# EAGLE design Barometer Sensor(BMP180) v1.0 (EAGLE 6.4)
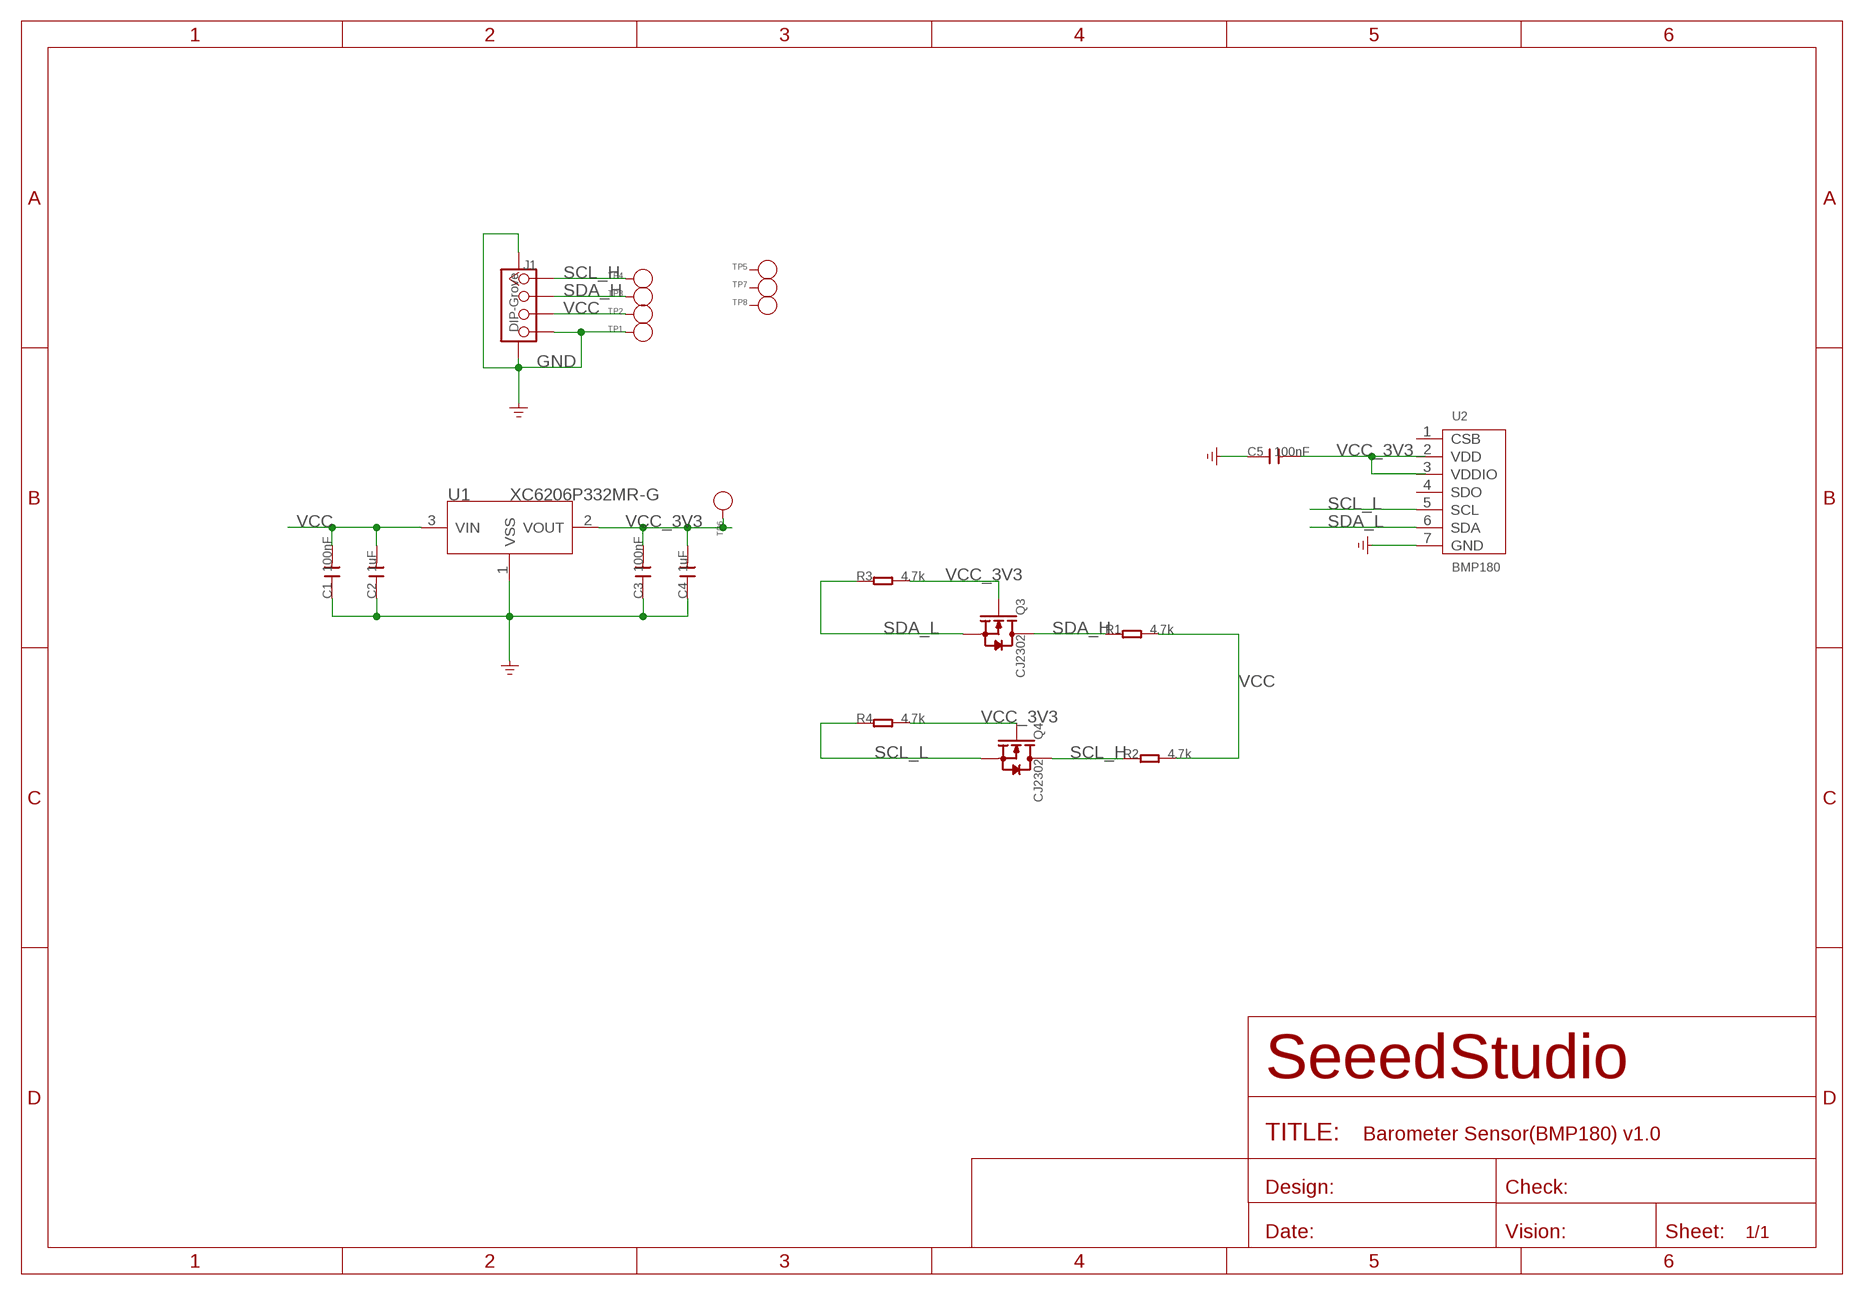
[diagram p0: schematic, sheet 1]

## Parts
C1  100nF  C-0603  [C0603]
C2  1uF  C-0603  [C0603]
C3  100nF  C-0603  [C0603]
C4  1uF  C-0603  [C0603]
C5  100nF  C-0603  [C0603]
J1  DIP-Grove  TWIG-4P-2.0-SMD-FEMALE-REINFORCE'DD'  [4P-SMD-2.0]
Q3  CJ2302  MOSFET-N-044020001  [SOT23]
Q4  CJ2302  MOSFET-N-044020001  [SOT23]
R1  4.7k  R-0603  [R0603]
R2  4.7k  R-0603  [R0603]
R3  4.7k  R-0603  [R0603]
R4  4.7k  R-0603  [R0603]
TP1  PAD-TEST-POINT'4545'  [TP_4545]
TP2  PAD-TEST-POINT'4545'  [TP_4545]
TP3  PAD-TEST-POINT'4545'  [TP_4545]
TP4  PAD-TEST-POINT'4545'  [TP_4545]
TP5  PAD-TEST-POINT'4545'  [TP_4545]
TP6  PAD-TEST-POINT'4545'  [TP_4545]
TP7  PAD-TEST-POINT'4545'  [TP_4545]
TP8  PAD-TEST-POINT'4545'  [TP_4545]
U1  XC6206P332MR-G  XC6206MR  [SOT23]
U2  BMP180  [LGA-7]

## Nets
GND: C1.1 C2.1 C3.1 C4.1 J1.4 J1.SS1 J1.SS2 TP1.T U1.1(VSS) U2.7(GND)
SCL_H: J1.1 Q4.3(D) R2.1 TP4.T
SCL_L: Q4.2(S) R4.1 U2.5(SCL)
SDA_H: J1.2 Q3.3(D) R1.1 TP3.T
SDA_L: Q3.2(S) R3.1 U2.6(SDA)
VCC: C1.2 C2.2 J1.3 R1.2 R2.2 TP2.T U1.3(VIN)
VCC_3V3: C3.2 C4.2 C5.2 Q3.1(G) Q4.1(G) R3.2 R4.2 TP6.T U1.2(VOUT) U2.2(VDD) U2.3(VDDIO)
Unconnected: C5.1 TP5.T TP7.T TP8.T U2.1(CSB) U2.4(SDO)

## Library data of the parts
C1-C5 = Discrete:C*: Ceramic Capacitors
J1 = Connector :TWIG-4P-2.0-SMD-FEMALE-REINFORCE
Q3 Q4 = OPL:MOSFET-N: CJ2302：SMD MOSFET N-CH 20V-2.1A
R1-R4 = Discrete:R*
TP1-TP8 = Discrete:PAD-TEST-POINT; PARTNO: DNP
U1 = IC:XC6206: LOW ESR Cap.Compatible Positive Voltage Regulators
U2 = template :BMP180: Digital pressure sensor

## Board
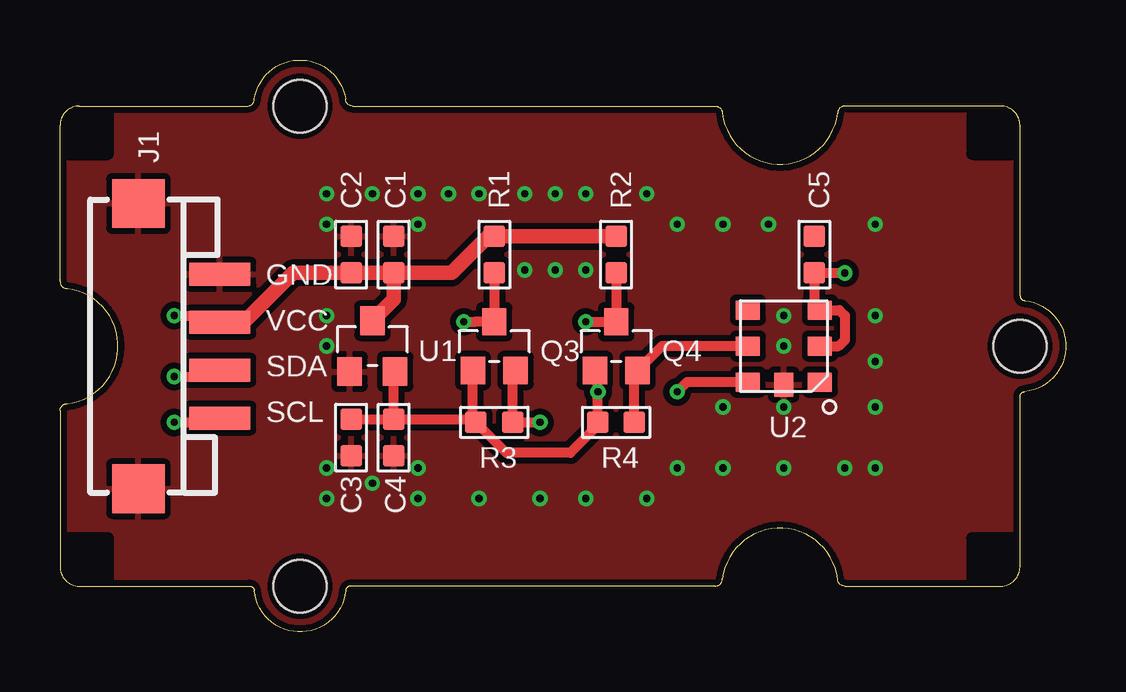
[diagram p1: board, top side]
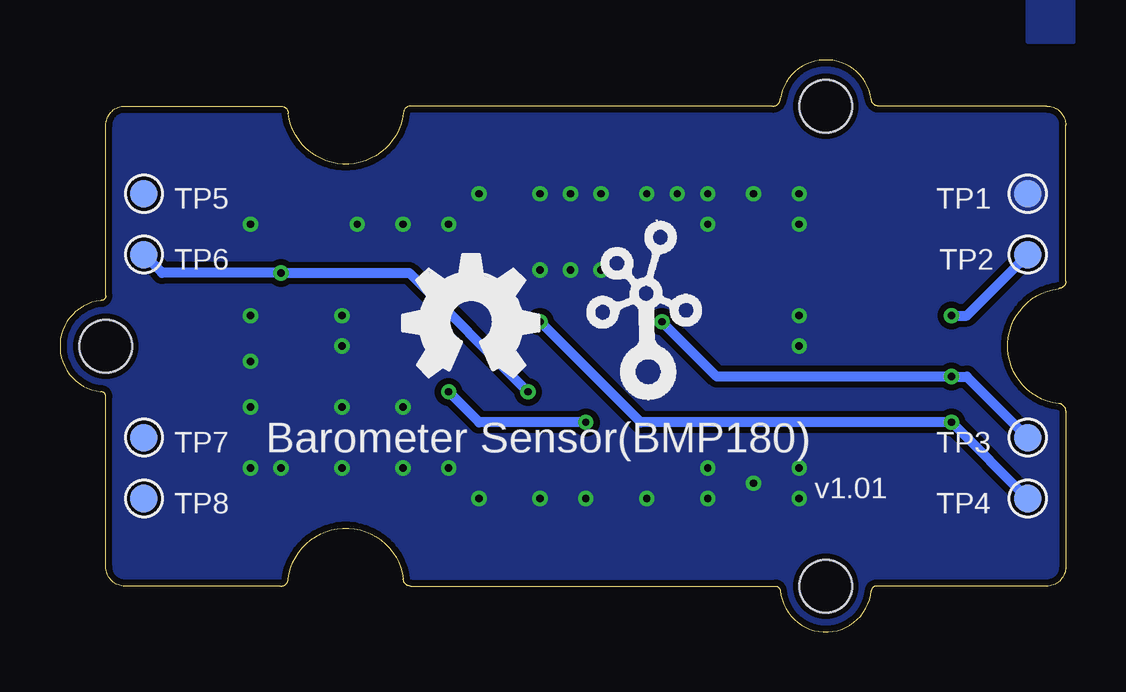
[diagram p2: board, bottom side, seen from below]

Size 41.91 x 23.83 mm. Coordinates in mm from the lower left corner, seen from the top.
Copper layers (1*16): Top 0.035mm / dielectric 1.5mm / Bottom 0.035mm
Design rules "SeeedStudio_2layer_DRU_no_angle_20140221": minimum track width 6mil, minimum drill 12mil, track to track 6mil, track to pad 6mil, pad to pad 6mil, via to via 6mil, smd to smd 0mil, copper to edge 10mil, drill to drill 10mil, minimum pad ring 10mil, minimum via ring 6mil, stop-mask expansion 2mil, vias tented up to drill 25mil, thermal gap 10mil

### Footprints (pad centres in the part's own frame; a part is rotated, then mirrored left to right if it is on the bottom)
C0603 = smd 0.889 x 0.889: 1 -0.762,0; 2 0.762,0
4P-SMD-2.0 = smd 0.965 x 2.54: 1 -3,0; 2 -1,0; 3 1,0; 4 3,0 | smd 2.032 x 2.184: SS1 -5.946,3.4; SS2 5.946,3.4
SOT23 = smd 1.016 x 1.143: 1 -0.889,-1.016; 2 0.889,-1.016; 3 0,1.016
R0603 = smd 0.889 x 0.889: 1 -0.762,0; 2 0.762,0
TP_4545 = smd 1.143 x 1.143: T 0,0
SOT23' = smd 1.016 x 1.2: 1 -0.95,-1.06; 2 0.95,-1.06; 3 0,1.06
LGA-7 = smd 0.8 x 1: 1 1.5,1.5; 2 0,1.5; 3 -1.5,1.5; 4 -1.5,-1.5; 5 0,-1.5; 6 1.5,-1.5 | smd 1 x 0.8: 7 1.6,0
GROVE-2CONNECTOR-SMD = hole 2.2: -10,-10; -10,10; 20,0

### Placement (x,y rotation side)
C1  13.9,15.72 270 top
C2  12.13,15.72 270 top
C3  12.13,8.1 90 top
C4  13.9,8.1 90 top
C5  31.43,15.72 270 top
J1  6.66,11.91 90 top
Q3  18.09,11.91 0 top
Q4  23.18,11.91 0 top
R1  18.09,15.72 90 top
R2  23.18,15.72 90 top
R3  18.09,8.73 180 top
R4  23.18,8.73 180 top
TP1  1.59,18.26 0 bottom
TP2  1.59,15.72 0 bottom
TP3  1.59,8.1 0 bottom
TP4  1.59,5.56 0 bottom
TP5  38.41,18.26 0 bottom
TP6  38.41,15.72 0 bottom
TP7  38.41,8.1 0 bottom
TP8  38.41,5.56 0 bottom
U1  XC6206P332MR-G  [SOT23']  13.02,11.91 0 top
U2  30.16,11.91 270 top
U$6  [GROVE-2CONNECTOR-SMD]  20,11.91 0 top
U$7  [OSHW_FILLX200_NOTEXT]  27.62,10.64 0 bottom
U$8  [TWIGLOGO]  17.46,10.64 0 bottom

### Tracks (layer width: path | path; a pad name or v marks a point on that pad's centre or on a via)
GND  (via drill 0.3 pad 0.64)
  other vias: 30.16,11.91 30.16,13.18 30.16,9.37 11.11,6.83 14.92,6.83 13.02,6.19 11.11,5.56 14.92,5.56 11.11,16.99 11.11,18.26 14.92,16.99 14.92,18.26 13.02,18.26 11.11,11.91 11.11,13.18 17.46,5.56 20,5.56 21.91,5.56 19.36,18.26 20.64,18.26 21.91,18.26 17.46,18.26 16.19,18.26 24.45,5.56 27.62,9.37 33.97,13.18 33.97,11.27 33.97,9.37 29.52,16.99 27.62,16.99 25.71,16.99 33.97,16.99 25.71,6.83 27.62,6.83 30.16,6.83 24.45,18.26 32.7,6.83 33.97,6.83 21.91,15.08 20.64,15.08 19.36,15.08
  pour Bottom: -0.32,26.51 1.59,26.51 1.59,24.61 -0.32,24.61
  pour Bottom (isolate 0.254): -0.32,23.97 42.23,23.97 42.23,-0.16 -0.32,-0.16
  pour Top (isolate 0.254): -0.32,23.97 42.23,23.97 42.23,-0.16 -0.32,-0.16
SCL_H  (via drill 0.3 pad 0.64)
  Top 0.406: v4.76,8.73 6.49,8.73 J1.1 | R2.1 Q4.3 v21.91,12.92
  Bottom 0.406: TP4.T v4.76,8.73 17.71,8.73 v21.91,12.92
SCL_L
  Top 0.406: R4.1 23.94,10.77 Q4.2 25.08,11.91 U2.5
SDA_H  (via drill 0.3 pad 0.64)
  Top 0.406: v4.76,10.64 6.39,10.64 J1.2 | R1.1 Q3.3 17.33,12.92 v16.82,12.92
  Bottom 0.406: TP3.T 4.12,10.64 v4.76,10.64 14.54,10.64 v16.82,12.92
SDA_L  (via drill 0.3 pad 0.64)
  Top 0.406: Q3.2 18.86,10.77 R3.1 v20,8.73 | 25.84,10.13 v25.71,10 26.12,10.41 U2.6
  Bottom 0.406: v20,8.73 24.45,8.73 v25.71,10
VCC  (via drill 0.3 pad 0.64)
  Top 0.406: v4.76,13.18 6.39,13.18 J1.3
  Top 0.61: C1.2 C2.2 9.71,14.96 7.66,12.91 J1.3 | C1.2 13.9,13.86 U1.3 | R2.2 R1.2 17.84,16.48 16.32,14.96 C1.2
  Bottom 0.406: v4.76,13.18 4.12,13.18 TP2.T
VCC_3V3  (via drill 0.3 pad 0.64)
  Top 0.406: C4.2 13.9,10.79 U1.2 | C3.2 C4.2 | C4.2 17.21,8.86 | 17.21,8.86 R3.2 18.6,7.46 21.27,7.46 22.41,8.61 R4.2 v22.41,10 22.41,10.77 Q4.1 | U2.2 32.45,11.91 32.7,12.16 32.7,13.18 32.47,13.41 U2.3 31.43,13.64 C5.2 v32.7,14.96 | 17.21,8.86 Q3.1
  Bottom 0.406: TP6.T 37.65,14.96 v32.7,14.96 27.37,14.96 v22.41,10

### Text on the board
tPlace: GND | VCC | SDA | SCL
bPlace: Barometer Sensor(BMP180) | v1.01